# Altium schematic sheet MP8756GD_2.SchDoc
size A4; SheetNumber: 8; SheetTotal: 16
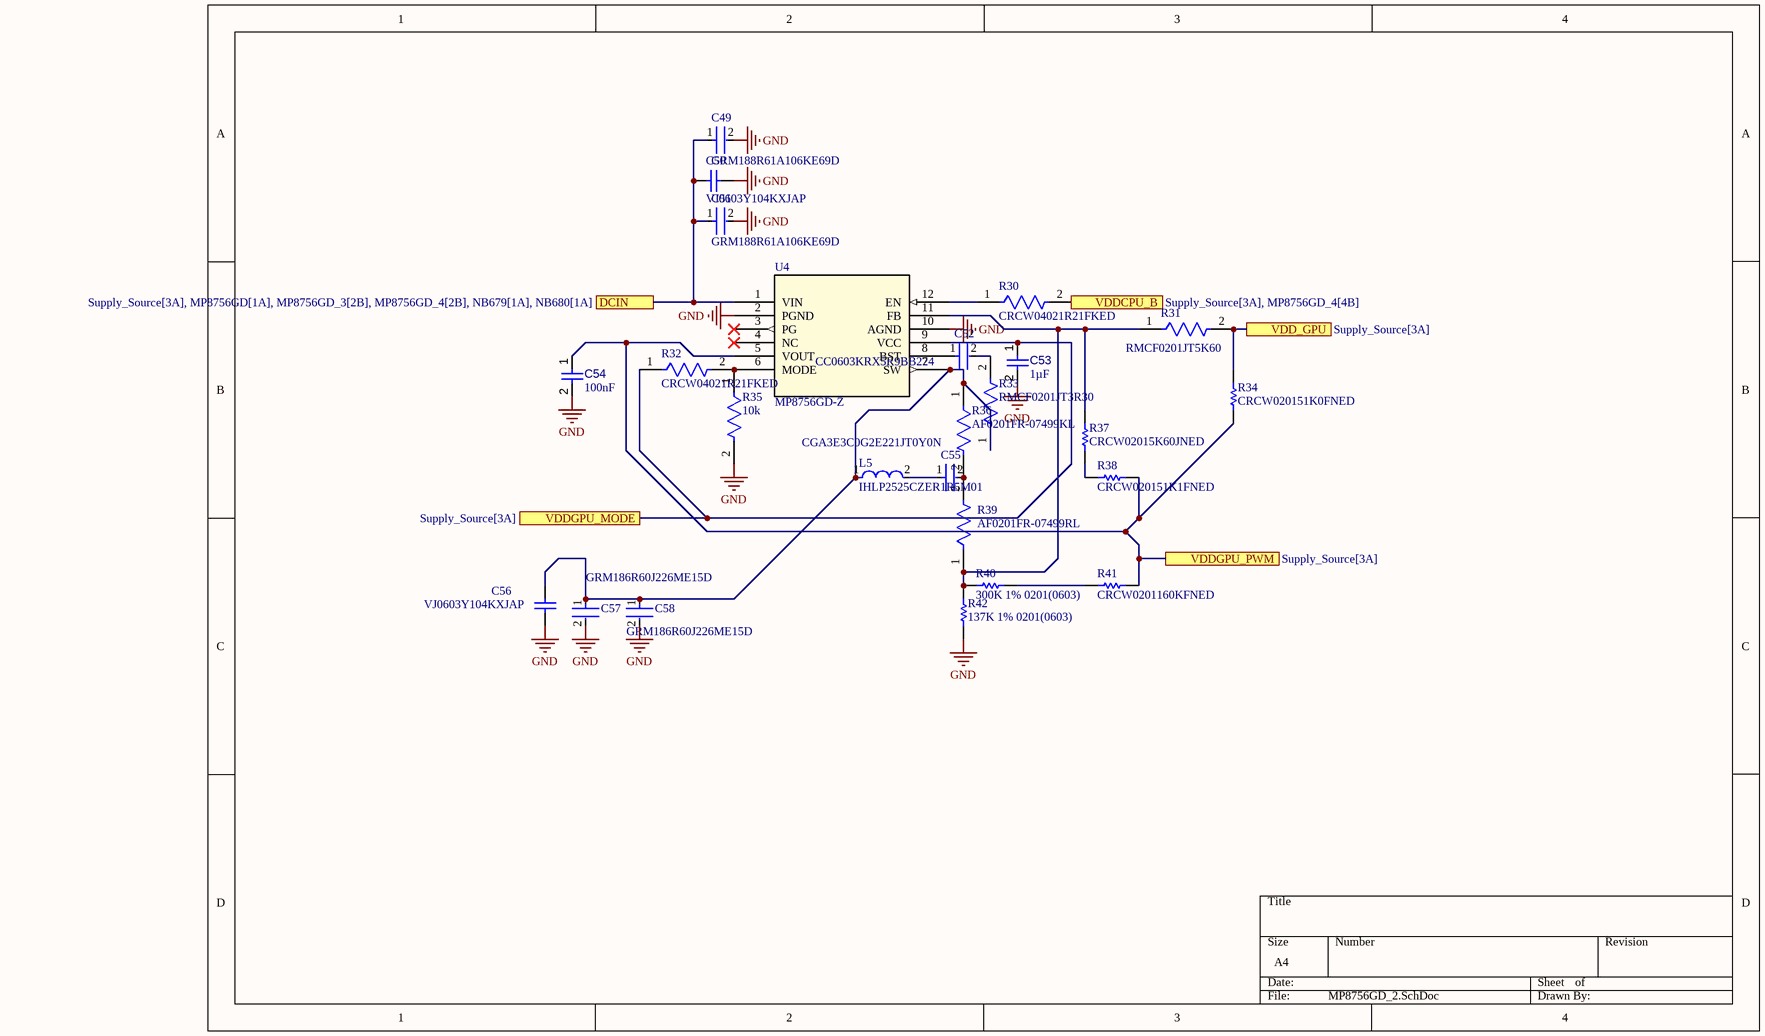
[diagram p0: MP8756GD_2.SchDoc]

## Parts
C49  GRM188R61A106KE69D  [FP-GRM18-0_15-MFG]
C50  VJ0603Y104KXJAP  [CAPC1608X92X38NL15T08]
C51  GRM188R61A106KE69D  [FP-GRM18-0_15-MFG]
C52  CC0603KRX5R9BB224  [FP-CC0603-DA-MFG]
C53  value 1µF  [CAPC1005X55X25LL05T10]  (hidden comment: Capacitor 1 uF +/- 10% 6.3 V 0402)
C54  value 100nF  [CAPC1005X56X25LL10T15]  (hidden comment: Capacitor 0.1 uF +/- 5% 16 V 0402)
C55  CGA3E3C0G2E221JT0Y0N  [FP-CGA3E-0_3-0_1-IPC_B]
C56  VJ0603Y104KXJAP  [CAPC1608X92X38NL15T08]
C57  GRM186R60J226ME15D  [FP-GRM186-0_2-IPC_B]
C58  GRM186R60J226ME15D  [FP-GRM186-0_2-IPC_B]
L5  IHLP2525CZER1R5M01  [FP-IHLP-2525CZ-FP_2_413x3-MFG]
R30  CRCW04021R21FKED  [FP-CRCW0402-e3-MFG]
R31  RMCF0201JT5K60  [FP-RMCF0201-MFG]
R32  CRCW04021R21FKED  [FP-CRCW0402-e3-MFG]
R33  RMCF0201JT3R30  [FP-RMCF0201-IPC_A]
R34  CRCW020151K0FNED  [RESC0603X28X15LL05T05]
R35  value 10k  [FP-RT0201-IPC_C]  (hidden comment: RT0201BRE0710KL)
R36  AF0201FR-07499KL  [FP-AF0201-MFG]
R37  CRCW02015K60JNED  [RESC0603X28X15NL05T05]
R38  CRCW020151K1FNED  [RESC0603X28X15ML05T05]
R39  AF0201FR-07499RL  [FP-AF0201-IPC_A]
R40  300K 1% 0201(0603)  [RESC0201(0603)_L]
R41  CRCW0201160KFNED  [RESC0603X28X15ML05T05]
R42  137K 1% 0201(0603)  [RESC0201(0603)_M]
U4  MP8756GD-Z  [QFN-12_MP8756_MNP]

## Ports
DCIN (see Supply_Source[3A], MP8756GD[1A], MP8756GD_3[2B], MP8756GD_4[2B], NB679[1A], NB680[1A]), VDD_GPU (see Supply_Source[3A]), VDDCPU_B (see Supply_Source[3A], MP8756GD_4[4B]), VDDGPU_MODE (see Supply_Source[3A]), VDDGPU_PWM (see Supply_Source[3A])

## Nets
GND: C49.2 C50.1 C51.2 C53.2 C54.2 C56.1 C57.2 C58.2 R35.2 R42.1 U4.2(PGND) U4.10(AGND)
DCIN: C49.1 C50.2 C51.1 U4.1(VIN) ; port DCIN
VDD_GPU: R31.2 R34.1 ; port VDD_GPU
VDDCPU_B: R30.2 ; port VDDCPU_B
VDDGPU_MODE: C53.1 R32.1 U4.9(VCC) ; port VDDGPU_MODE
VDDGPU_PWM: C54.1 R34.2 R38.2 R41.2 U4.5(VOUT) ; port VDDGPU_PWM
NetC52_1: C52.1 U4.8(BST)
NetC52_2: C52.2 R33.2
NetC55_1: C55.1 L5.2
NetC55_2: C55.2 R36.2 R39.2
NetC56_2: C56.2 C57.1 C58.1 L5.1 R33.1 R36.1 U4.7(SW)
NetR30_1: R30.1 U4.12(EN)
NetR31_1: R31.1 R37.1 R39.1 R40.1 R42.2 U4.11(FB)
NetR32_2: R32.2 R35.1 U4.6(MODE)
NetR37_2: R37.2 R38.1
NetR40_2: R40.2 R41.1

Not connected (* = marked no-connect by the designer): U4 3(PG)* 4(NC)*

## Library data of the parts
C49 C51 = CMP-2000-05448-2: CAP CER 10UF 10V X5R 0603; Manufacturer: Murata; Temperature Coefficient: 15%; Material: Ceramic; Tolerance: 10%; Device Class L1: Passive Components; ComponentLink2Description: Datasheet; Height: 0.95mm; Package: GRM18-0.15; Octopart: https://octopart.com/grm188r61a106ke69d-murata-22851381; Manufacturer Part Number: GRM188R61A106KE69D; Value: 10uF; Digikey Description: CAP CER 10UF 10V X5R 0603; Temperature Range High: +85°C; Temperature Range Low: -55°C; Temperature Characteristic: X5R; Capacitance: 10uF; RoHS: TRUE; Device Class L2: Capacitors; ComponentLink2URL: https://search.murata.co.jp/Ceramy/image/img/A01X/G101/ENG/GRM188R61A106KE69-01A.pdf; Device Class L3: Ceramic Capacitors; Lead Free: Yes; Mouser Description: Multilayer Ceramic Capacitors MLCC - SMD/SMT 0603 10uF 10volts X5R + - 10%; Category: Cap; Voltage Rating: 10V; Temperature: -55°C to +85°C; Automotive: No
C50 C56 = CMP-2006-01211-1: Manufacturer: Vitramon; Part Number: VJ0603Y104KXJAP
C52 = CMP-03422-000839-1: CC0603 220 nF X5R 10.00% 50 V; Manufacturer: YAGEO; Tolerance: 0.1; Capacitance: 220 nF; Temperature Coefficient: 15%; Material: Ceramic; Voltage Rating: 50 V; Value: 220 nF; Package: CC0603-DA; Temperature: -55°C to +125°C; Automotive: No; ComponentLink2URL: http://www.yageo.com/documents/recent/UPY-GPHC_X7R_6.3V-to-50V_18.pdf; Device Class L1: Passive Components; Footprint Url: http://www.yageo.com/exep/pages/download/literatures/UPY-C_GEN_24.pdf; Mouser Description: Surface Mount Ceramic Multilayer Capacitor 0.22uF 10% X5R 50V 0603 Paper T/R; Temperature Range Low: -55°C; ComponentLink2Description: Datasheet; Temperature Characteristic: X5R; Category: Cap; Octopart: https://octopart.com/cc0603krx5r9bb224-yageo-90326743; Device Class L3: Ceramic Capacitors; RoHS: TRUE; Device Class L2: Capacitors; Height: 0.9mm; Manufacturer Part Number: CC0603KRX5R9BB224; Temperature Range High: +125°C; Voltage: 50 V; Lead Free: Yes
C53 = CMP-001-00008-6: Chip Capacitor, 1 uF, +/- 10%, 6.3 V, 0402 (1005 Metric); Capacitor Type: Ceramic; Voltage Rating: 6.3V; Max Operating Temperature: 85°C; Mounting Technology: SM; Tolerance: 10%; Case/Package: 0402; RoHS Compliant: True; Min Operating Temperature: -55°C; Pins: 2
C54 = CMP-001-00001-6: Chip Capacitor, 0.1 uF, +/- 5%, 16 V, 0402 (1005 Metric); Capacitor Type: Ceramic; Voltage Rating: 16V; Max Operating Temperature: 125°C; Min Operating Temperature: -55°C; Case/Package: 0402; Mounting Technology: SM; Pins: 2; Tolerance: 5%; RoHS Compliant: True
C55 = CMP-08246-002038-1: Cap Ceramic 220pF 250V C0G 5% Pad SMD 0603 +125°C Automotive T/R
C57 C58 = CMP-06035-038491-1: Chip Multilayer Ceramic Capacitors for General Purpose, 0603, 22uF, X5R, 15%, 20%, 6.3V; Mount: Surface Mount; Thickness: 0.028inch; Tolerance: 20%; Width: 0.031inch; Voltage Rating (DC): 6.3V; Min Operating Temperature: -55°C; Voltage Rating: 6.3V; Capacitance: 22uF; Dielectric: X5R; Case Code (Imperial): 0603; Length: 0.063inch; Case/Package: 0603; Packaging: Tape and Reel; Case Code (Metric): 1608; Max Operating Temperature: 85°C
L5 = CMP-2000-06441-2: Commercial Inductors, High Saturation Series 1.5uH 9A 15mΩ 20%; DC Resistance (DCR): 15mR; Shielding: Shielded; Self Resonant Frequency: 5MHz; Max DC Current: 18A; Test Frequency: 100kHz; Core Material: Metal; Packaging: Tape and Reel; RMS Current (Irms): 9A; Length: 7.24mm; Case Code (Imperial): 2525; Case/Package: 2525; Min Operating Temperature: -55°C; Number of Pins: 2; Contact Plating: Tin; Height: 3mm; Height - Seated (Max): 0.118inch; Termination: SMD/SMT; Max Operating Temperature: 125°C; Depth: 6.72mm; Width: 6.47mm; Current Rating: 9A; Tolerance: 20%; Lead Free: Lead Free; Military Standard: Not; Radiation Hardening: No; Saturation Current: 18A; Package Quantity: 2000; Inductance Tolerance: 20%; Inductance: 1.5uH; Mount: Surface Mount
R30 R32 = CMP-2002-00308-2: RES Thick Film, 1.21Ω, 1%, 0.063W, 100ppm/°C, 0402; Power Rating: 63mW; Voltage Rating: 50V; Resistance: 1.21R; Height: 0.016inch; Length: 0.039inch; Temperature Coefficient: 100ppm/°C; Case/Package: 0402; Package Quantity: 10; Case Code (Metric): 1005; Radiation Hardening: No; Min Operating Temperature: -55°C; Tolerance: 1%; Weight: 2.3E-05oz; Max Power Dissipation: 63mW; Packaging: Tape and Reel; Composition: Thick Film; Contact Plating: Tin; Termination: SMD/SMT; Case Code (Imperial): 0402; Width: 0.5mm; Features: Automotive AEC-Q200; Number of Terminations: 2; Lead Free: Lead Free; Max Operating Temperature: 155°C
R31 = CMP-26527-005560-1: 5.6kΩ ±5% 0.05W 0201 Thick Film Chip Resistor AEC-Q200 compliant; Max Power Dissipation: 50mW; Resistance: 5.6kR; Temperature Coefficient: 200ppm/°C; Case/Package: 0201; Case Code (Imperial): 0201; Resistor Type: Thick Film; Min Operating Temperature: -55°C; Width: 0.012inch; Contact Plating: Tin; RoHS Compliant: Yes; Packaging: Tape and Reel; Radiation Hardening: No; Case Code (Metric): 0603; Mount: Surface Mount; Length: 0.024inch; Tolerance: 5%; Number of Terminations: 2; Series: RMCF; Max Operating Temperature: 125°C; Height: 0.009inch
R33 = CMP-26527-006332-1: 3.3Ω ±5% 0.05W 0201 Thick Film Chip Resistor AEC-Q200 compliant; Temperature Coefficient: 400ppm/°C; Resistance: 3.3R; Max Power Dissipation: 50mW; Mount: Surface Mount; Resistor Type: Thick Film; Series: RMCF; Tolerance: 5%; Contact Plating: Tin; Max Operating Temperature: 125°C; Radiation Hardening: No; Min Operating Temperature: -55°C; Height: 0.009inch; Number of Terminations: 2; Packaging: Tape and Reel; RoHS Compliant: Yes; Length: 0.024inch; Width: 0.012inch; Case/Package: 0201
R34 = CMP-2004-00692-1: Manufacturer: Vishay Dale; Part Number: CRCW020151K0FNED
R35 = CMP-009-00210-1: Fixed Resistor, Thin Film, 0.05W, 10000ohm, 25V, 0.1% +/-Tol, 50ppm/Cel, Surface Mount, 0201; Max Operating Temperature: 125°C; Min Operating Temperature: -55°C; Case/Package: 0201; Mounting Technology: Surface Mount; Voltage Rating: 25V; Tolerance: 0.1%
R36 = CMP-03412-049532-1: Anti-Sulfurated Chip Resistors Automotive Grade 499kΩ 1% 200ppm/°C 0201; Resistance: 499kR; Max Power Dissipation: 50mW; Packaging: Tape and Reel; Height: 0.01inch; Temperature Coefficient: 200ppm/°C; Width: 0.012inch; Case/Package: 0201; Max Operating Temperature: 125°C; Features: Moisture Resistant; Series: AF; Resistor Type: Thick Film; Min Operating Temperature: -55°C; Length: 0.024inch; Tolerance: 1%; Number of Terminations: 2; RoHS Compliant: Yes
R37 = CMP-2004-00746-1: Manufacturer: Vishay Dale; Part Number: CRCW02015K60JNED
R38 = CMP-2004-00695-1: Manufacturer: Vishay Dale; Part Number: CRCW020151K1FNED
R39 = CMP-03412-047469-1: Anti-Sulfurated Chip Resistors Automotive Grade 499Ω 1% 200ppm/°C 0201; Max Power Dissipation: 50mW; Resistance: 499R; Min Operating Temperature: -55°C; Height: 0.01inch; Features: Moisture Resistant; Resistor Type: Thick Film; Temperature Coefficient: 200ppm/°C; Width: 0.012inch; Case/Package: 0201; Number of Terminations: 2; Max Operating Temperature: 125°C; Packaging: Tape and Reel; Series: AF; RoHS Compliant: Yes; Tolerance: 1%; Length: 0.024inch
R40 = CMP-1010-00694-1: 300K 0.05W 1% 0201 (0603 Metric)  SMD; Case-Metric: 0603; Value: 300000.00 Ohm; Case-EIA: 0201; Power: 0.05 W; Technology: SMT; Tolerance: 1 %
R41 = CMP-2004-00140-1: Manufacturer: Vishay Dale; Part Number: CRCW0201160KFNED
R42 = CMP-1010-00656-1: 137K 0.05W 1% 0201 (0603 Metric)  SMD; Value: 137000.00 Ohm; Case-EIA: 0201; Case-Metric: 0603; Power: 0.05 W; Tolerance: 1 %; Technology: SMT
U4 = CMP-006-000002-1: 26V 6A Low IQ High-Current Synchronous Step-Down Converter; Manufacturer_Name: Monolithic Power Systems; Design Item ID: MP8756GD-Z; RefDes: RefDes; Manufacturer_Part_Number: MP8756GD-Z; Copyright: Copyright (C) 2025 Ultra Librarian. All rights reserved.; Type: Type; Source: MP8756GD-Z.SchLib